# Altium schematic sheet 4_PeripheralsV2.SchDoc
size Letter
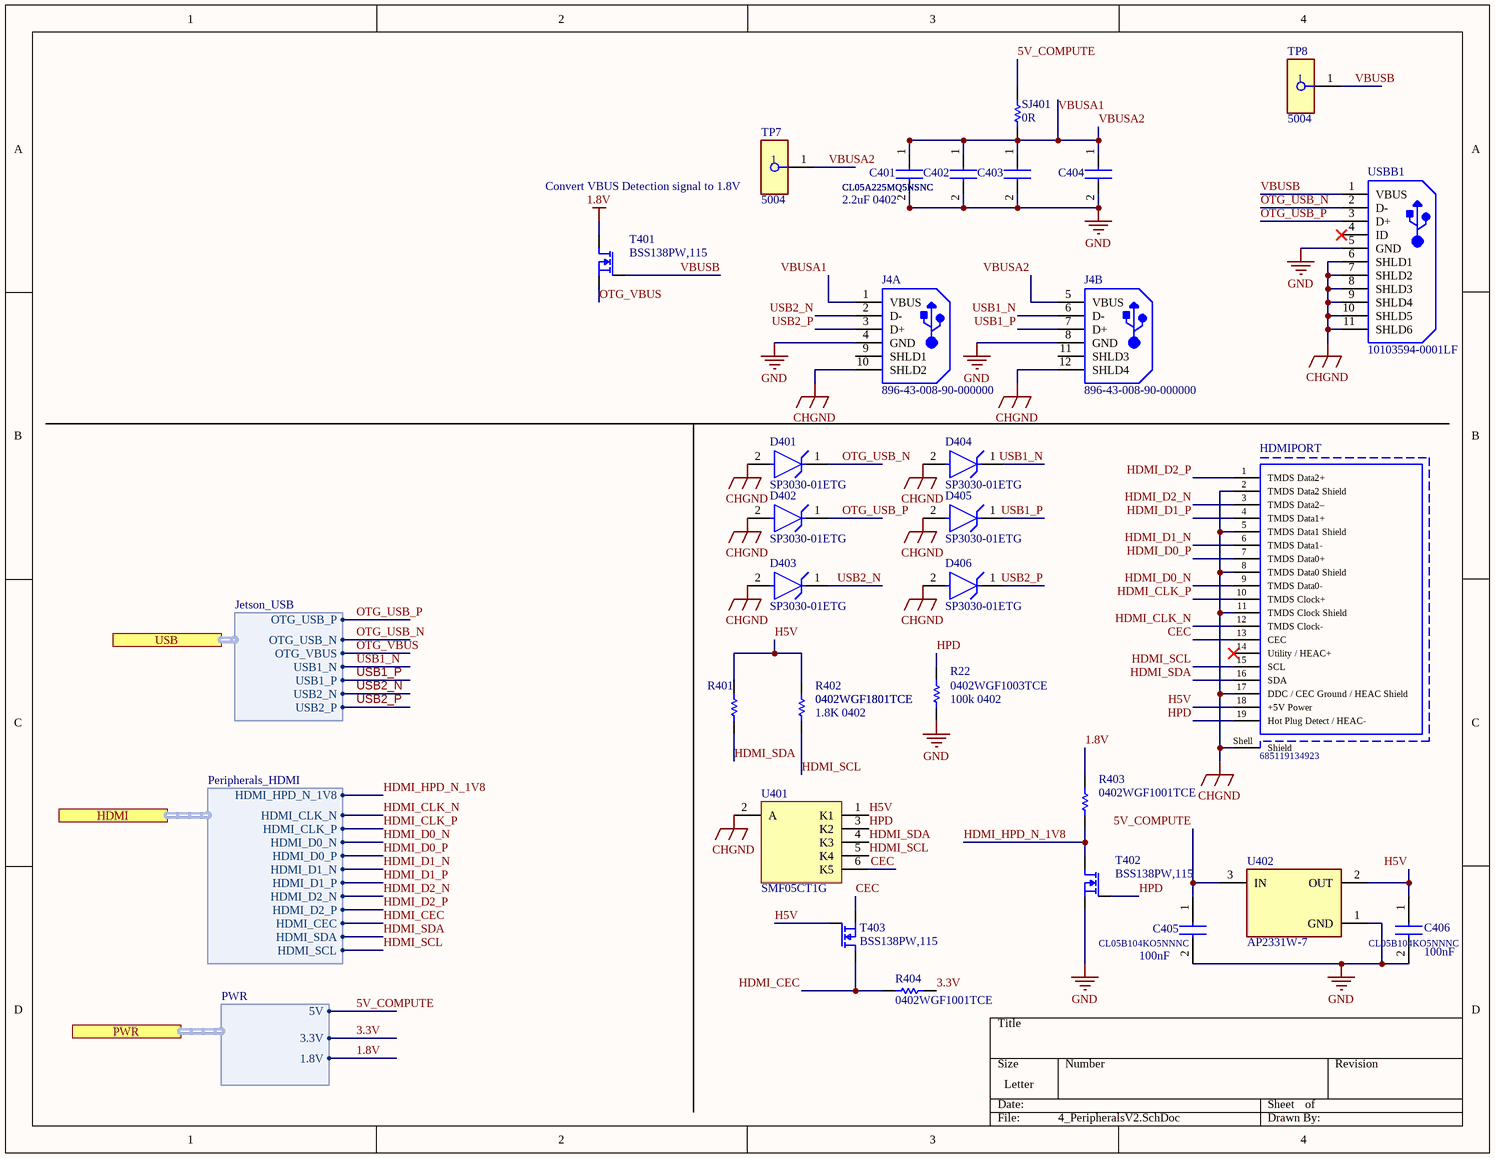
[diagram p0: 4_PeripheralsV2.SchDoc]

## Parts
C401  CL05A225MQ5NSNC  [CAPC1005X55N]
C402  CL05A225MQ5NSNC  [CAPC1005X55N]
C403  CL05A225MQ5NSNC  [CAPC1005X55N]
C404  CL05A225MQ5NSNC  [CAPC1005X55N]
C405  CL05B104KO5NNNC  value 100nF  [CAPC1005X55N]
C406  CL05B104KO5NNNC  value 100nF  [CAPC1005X55N]
D401  SP3030-01ETG  [FP-SP3030-MFG]
D402  SP3030-01ETG  [FP-SP3030-MFG]
D403  SP3030-01ETG  [FP-SP3030-MFG]
D404  SP3030-01ETG  [FP-SP3030-MFG]
D405  SP3030-01ETG  [FP-SP3030-MFG]
D406  SP3030-01ETG  [FP-SP3030-MFG]
HDMIPORT  685119134923  [685119134923]
J4  896-43-008-90-000000  [MILL-896-43-008-90-000000_V]  (parts A,B of 2)
R22  0402WGF1003TCE  [0402]
R401  0402WGF1801TCE  [0402]
R402  0402WGF1801TCE  value 1.8K 0402  [0402]
R403  0402WGF1001TCE  [0402]
R404  0402WGF1001TCE  [0402]
SJ401  0R  [J1-0603]
T401  BSS138PW,115  [SC70-3]
T402  BSS138PW,115  [SC70-3]
T403  BSS138PW,115  [SC70-3]
TP7  5004  [FP-5004-MFG]
TP8  5004  [FP-5004-MFG]
U401  SMF05CT1G  [ONSC-SC70-6-419B-02_W_V]
U402  AP2331W-7  [FP-SC59-IPC_B]
USBB1  10103594-0001LF  [FCI-10103594-0001LF_V]

## Ports
HDMI (harness Peripherals_HDMI), PWR (harness PWR), USB (harness Jetson_USB)

## Harnesses
Peripherals_HDMI: HDMI_HPD_N_1V8, HDMI_CLK_N, HDMI_CLK_P, HDMI_D0_N, HDMI_D0_P, HDMI_D1_N, HDMI_D1_P, HDMI_D2_N, HDMI_D2_P, HDMI_CEC, HDMI_SDA, HDMI_SCL
PWR: 5V, 3.3V, 1.8V
Jetson_USB: OTG_USB_P, OTG_USB_N, USB1_N, USB1_P, USB2_N, USB2_P, OTG_VBUS

## Nets
1.8V: R403.1 T401.3(D) ; port PWR.1.8V
CHGND: D401.2(A) D402.2(A) D403.2(A) D404.2(A) D405.2(A) D406.2(A) HDMIPORT.2(TMDS_Data2_Shield) HDMIPORT.5(TMDS_Data1_Shield) HDMIPORT.8(TMDS_Data0_Shield) HDMIPORT.11(TMDS_Clock_Shield) HDMIPORT.17(DDC_/_CEC_Ground_/_HEAC_Shield) HDMIPORT.Shell(Shield) J4.10(SHLD2) J4.12(SHLD4) U401.2(A) USBB1.6(SHLD1) USBB1.7(SHLD2) USBB1.8(SHLD3) USBB1.9(SHLD4) USBB1.10(SHLD5) USBB1.11(SHLD6)
GND: C401.2 C402.2 C403.2 C404.2 C405.2 C406.2 J4.4(GND) J4.8(GND) R22.2 T402.2(S) U402.1(GND) USBB1.5(GND)
3.3V: R404.2 ; port PWR.3.3V
5V_COMPUTE: C405.1 SJ401.2 U402.3(IN) ; port PWR.5V
CEC: HDMIPORT.13(CEC) T403.2(S) U401.6(K5)
H5V: C406.1 HDMIPORT.18(+5V_Power) R401.2 R402.2 T403.1(G) U401.1(K1) U402.2(OUT)
HDMI_CEC: R404.1 T403.3(D) ; port HDMI.HDMI_CEC
HDMI_CLK_N: HDMIPORT.12(TMDS_Clock-) ; port HDMI.HDMI_CLK_N
HDMI_CLK_P: HDMIPORT.10(TMDS_Clock+) ; port HDMI.HDMI_CLK_P
HDMI_D0_N: HDMIPORT.9(TMDS_Data0-) ; port HDMI.HDMI_D0_N
HDMI_D0_P: HDMIPORT.7(TMDS_Data0+) ; port HDMI.HDMI_D0_P
HDMI_D1_N: HDMIPORT.6(TMDS_Data1-) ; port HDMI.HDMI_D1_N
HDMI_D1_P: HDMIPORT.4(TMDS_Data1+) ; port HDMI.HDMI_D1_P
HDMI_D2_N: HDMIPORT.3(TMDS_Data2–) ; port HDMI.HDMI_D2_N
HDMI_D2_P: HDMIPORT.1(TMDS_Data2+) ; port HDMI.HDMI_D2_P
HDMI_HPD_N_1V8: R403.2 T402.3(D) ; port HDMI.HDMI_HPD_N_1V8
HDMI_SCL: HDMIPORT.15(SCL) R402.1 U401.5(K4) ; port HDMI.HDMI_SCL
HDMI_SDA: HDMIPORT.16(SDA) R401.1 U401.4(K3) ; port HDMI.HDMI_SDA
HPD: HDMIPORT.19(Hot_Plug_Detect_/_HEAC-) R22.1 T402.1(G) U401.3(K2)
OTG_USB_N: D401.1(C) USBB1.2(D-) ; port USB.OTG_USB_N
OTG_USB_P: D402.1(C) USBB1.3(D+) ; port USB.OTG_USB_P
OTG_VBUS: T401.2(S) ; port USB.OTG_VBUS
USB1_N: D404.1(C) J4.6(D-) ; port USB.USB1_N
USB1_P: D405.1(C) J4.7(D+) ; port USB.USB1_P
USB2_N: D403.1(C) J4.2(D-) ; port USB.USB2_N
USB2_P: D406.1(C) J4.3(D+) ; port USB.USB2_P
VBUSA1: C401.1 C402.1 C403.1 C404.1 J4.1(VBUS) J4.5(VBUS) SJ401.1 TP7.1  [also labelled VBUSA2]
VBUSB: T401.1(G) TP8.1 USBB1.1(VBUS)

Not connected (* = marked no-connect by the designer): HDMIPORT 14(Utility_/_HEAC+)*; J4 9(SHLD1) 11(SHLD3); USBB1 4(ID)*

## Notes on the sheet
- (near TP7) Convert VBUS Detection signal to 1.8V
- (near C401) 2.2uF 0402
- (near R22) 100k 0402

## Library data of the parts
C401-C404 = C0402C560K5RACTU: 2.2uF 0402; Manufacturer_Name: Kemet; Datasheet Link: https://content.kemet.com/datasheets/KEM_C1002_X7R_SMD.pdf; Height: 0.55mm; Manufacturer_Part_Number: C0402C560K5RACTU; Arrow Part Number: C0402C560K5RACTU; Mouser Part Number: 80-C0402C560K5RACTU; Mouser Price/Stock: https://www.mouser.co.uk/ProductDetail/KEMET/C0402C560K5RACTU?qs=gt1LBUVyoHmQZW5v3ySgNQ%3D%3D
C405 C406 = C0402C560K5RACTU: 100nF 0402; Manufacturer_Name: Kemet; Datasheet Link: https://content.kemet.com/datasheets/KEM_C1002_X7R_SMD.pdf; Height: 0.55mm; Manufacturer_Part_Number: C0402C560K5RACTU; Arrow Part Number: C0402C560K5RACTU; Mouser Part Number: 80-C0402C560K5RACTU; Mouser Price/Stock: https://www.mouser.co.uk/ProductDetail/KEMET/C0402C560K5RACTU?qs=gt1LBUVyoHmQZW5v3ySgNQ%3D%3D
D401-D406 = CMP-08607-000070-1: TVS DIODE 5V 10V SOD882; Manufacturer: Littelfuse; Max Junction Temp: +150°C; Automotive Grade: Grade 1; Direction: Unidirectional; Peak Pulse Current: 3A; Capacitance: 0.5pF; Value: 0.5pF; Number Of Channels: 1; Manufacturer Part Number: SP3030-01ETG; Temperature Range Low: -40°C; Lead Free: Yes; Package: SP3030; Device Class L2: TVS Diodes; Height: 0.6mm; ComponentLink2URL: https://www.littelfuse.com/~/media/electronics/datasheets/tvs_diode_arrays/littelfuse_tvs_diode_array_sp3030_datasheet.pdf.pdf; Device Class L3: unset; Category: Diode; Reverse Standoff Voltage: 5V; RoHS: TRUE; Digikey Description: TVS DIODE 5V 10V SOD882; Octopart: https://octopart.com/sp3030-01etg-littelfuse-29687287; ComponentLink2Description: Datasheet; Device Class L1: Circuit Protection; Automotive: Yes; Temperature: -40°C to +125°C; Temperature Range High: +125°C; Clamping Voltage: 10V; Mouser Description: TVS Diodes / ESD Suppressors 5V 1uA 22kV UNIDIRECTIONAL
HDMIPORT = CMP-1502-00169-1: HDMI Type A Receptacle WR-HDMI, Horizontal, SMT; Manufacturer: Wurth Elektronik; Contact Resistance: 30mOhm; Working Voltage: 40VDC; Rated Current: 0.5A; Publisher: WurthElektronik; Datasheet URL: https://katalog.we-online.de/em/datasheet/685119134923.pdf; Gender: Receptacle; Manufacturer URL: http://www.we-online.de; Orientation: Horizontal; Mounting Technology: SMT; Part Number: 685119134923; Packaging: TapeandReel; Package Reference: 685119134923; Operating Temperature: -20to85degC; Connector Type: HDMITypeA; LCSC Part #: *
J4 = CMP-2000-05704-1: Double Row Type A USB Socket, USB 2.0, 8 Position, RoHS, Tray; Mounting Angle: Right; Insulation Resistance: 1000MOhms; Brand: Mill-Max; Number of Positions / Contacts: 4; Gender: Female; Number of Ports: 1; Connector Type: USBTypeAReceptacle; Datasheet URL: https://www.mill-max.com/products/datasheet/sockets/896-43-008-90-000000; Package Description: 8-Pin Through Hole Device, Body 16.967 x 14.503 mm; Mounting Technology: ThroughHole; Factory Pack Quantity: 120; Manufacturer URL: https://www.mill-max.com/; Package Reference: 896-43-008-90-000000; Contact Plating: Gold; Termination Style: SMD; Datasheet Version: 09/2016; Standard: USB; Manufacturer: Mill-Max; Product: USBTypeAConnectors; Number of Contacts: 4; Contact Material: CopperAlloy; RoHS: Details; Mounting Style: SMD/SMT; Number of Positions: 4; Product Category: USBConnectors; Packaging: Tube
R22 = Res1: 100k 0402; Published: 8-Jun-2000; LatestRevisionDate: 17-Jul-2002; LatestRevisionNote: Re-released for DXP Platform.; PackageReference: AXIAL-0.3; Publisher: Altium Limited; PackageDescription: Axial Device, Thru-Hole; 2 Leads; 0.3 in Pin Spacing
R401 R402 = Res1: 1.8k 0402; Published: 8-Jun-2000; LatestRevisionDate: 17-Jul-2002; LatestRevisionNote: Re-released for DXP Platform.; PackageReference: AXIAL-0.3; Publisher: Altium Limited; PackageDescription: Axial Device, Thru-Hole; 2 Leads; 0.3 in Pin Spacing
R403 R404 = Res1: 1k 0402; Published: 8-Jun-2000; LatestRevisionDate: 17-Jul-2002; LatestRevisionNote: Re-released for DXP Platform.; PackageReference: AXIAL-0.3; Publisher: Altium Limited; PackageDescription: Axial Device, Thru-Hole; 2 Leads; 0.3 in Pin Spacing
SJ401 = Res1: Resistor; Published: 8-Jun-2000; LatestRevisionDate: 17-Jul-2002; LatestRevisionNote: Re-released for DXP Platform.; PackageReference: AXIAL-0.3; Publisher: Altium Limited; PackageDescription: Axial Device, Thru-Hole; 2 Leads; 0.3 in Pin Spacing; Value: 0R; LCSC Part #: C21189
T401-T403 = NMOS: MOSFET, N CH, 60V, 0.2A; Manufacturer: NXP; Value: BSS138PW,115; PartNumber: BSS138PW,115; MPN: BSS138PW,115
TP7 TP8 = CMP-2000-05575-2: PC TEST POINT MINIATURE YELLOW; Manufacturer: Keystone; Number Of Contacts: 1; Is Female: yes; Device Class L1: Connectors; Manufacturer Part Number: 5004; Digikey Description: PC TEST POINT MINIATURE YELLOW; ComponentLink2URL: https://www.keyelco.com/product-pdf.cfm?p=1313; Lead Free: Yes; ComponentLink2Description: Datasheet; Category: Conn; Height: 4.72mm; Octopart: https://octopart.com/5004-keystone-28591; Mouser Description: TEST POINT PC MINI .040"D YELLOW; Device Class L3: unset; Contact Material: Silver; Package: 5004; Automotive: No; Device Class L2: unset; RoHS: TRUE
U401 = CMP-1061-00155-1: 5-Line Transient Voltage Suppressor Array, 6-Pin SC70, Pb-Free, Tape and Reel; Manufacturer: On Semiconductor; PPK Max (W): 100; Direction: Unidirectional; IR Max (uA): 5; PackageDescription: 6-Pin Small Outline Transistor, Body 2 x 1.25 mm, Pitch 0.65 mm; PackageReference: SC70-6-419B-02_W; ComponentLink2Description: Datasheet; Mounting Technology: Surface Mount; Packing: Tape and Reel; DatasheetVersion: Rev. 4; ComponentLink1Description: Manufacturer URL; ComponentLink2URL: http://www.onsemi.com/pub_link/Collateral/SMF05C-D.PDF; ComponentLink3Description: Package Specification; ComponentLink1URL: http://www.onsemi.com/; ComponentLink3URL: http://www.onsemi.com/pub_link/Collateral/SMF05C-D.PDF; PackageVersion: Rev. W; PartNumber: SMF05CT1G; RoHS: Pb-Free
U402 = CMP-12752-000002-1: LOAD SWITCH SC59; Min Supply Voltage: 2.7V; Interface: On/Off; Turn-On Delay Time: 700us; Voltage: 5.2V; Current: 200mA; Output Configuration: High Side; Number of Outputs: 1; On-State Resistance: 350mR; Fault Protection: Over Temperature; Min Operating Temperature: -40°C; Number of Pins: 59; Max Operating Temperature: 85°C; Height: 1.3mm; Package Quantity: 3000; REACH SVHC: No SVHC; Radiation Hardening: No; Output Current: 200mA; Max Supply Voltage: 5.2V; Max Output Current: 200mA; Case/Package: TO-236-3; Width: 1.7mm; Mount: Surface Mount; Packaging: Tape and Reel; Length: 3.1mm; LCSC Part #: *
USBB1 = CMP-1698-00007-1: Micro USB 2.0 B Receptacle, -55 to 85 degC, 5-Pin SMD, RoHS, Tape and Reel; Type (Resistor): Thick Film; Case\Package: 0603; Resistance: 4.7 kohm; Tolerance: 1%; Voltage Rating: 75 V; Power Rating: 100 mW; Case Code (Imperial): 0603; Case Code (Metric): 1608; REACH SVHC: Unknown; ComponentLink1URL: http://portal.fciconnect.com/; Package Quantity: 5000; RoHSCompliant: true; Max Operating Temperature: 155 degC; Min Operating Temperature: -55 degC; Mount: Surface Mount; Weight: 7.1E-05 oz; Length: 1.55 mm; PackageDescription: 5-Pin Surface Mount Device, Body 8.04 x 5.62 mm; Pins: 2; Height: 0.45 mm; ComponentLink2Description: Datasheet; ComponentLink2URL: http://portal.fciconnect.com/Comergent//fci/drawing/10103594.pdf; PackageReference: FCI-10103594-0001LF; DatasheetVersion: Rev. A, 06/2010; Width: 0.85 mm; Packaging: Tape and Reel; ComponentLink1Description: Manufacturer URL; LCSC Part #: *